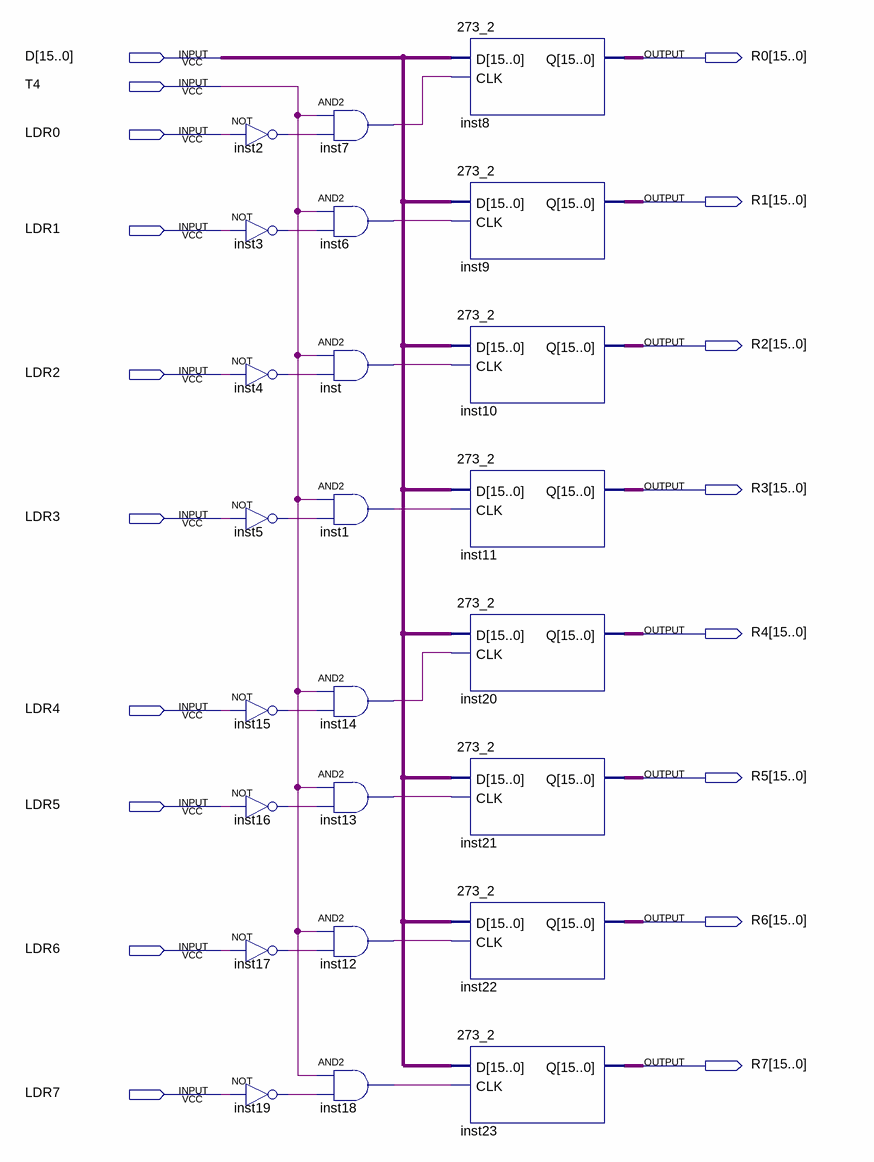
[diagram p0: schematic sheet]
// Quartus schematic reg_3.bdf as structural Verilog: 24 symbols, 18 pins
module reg_3 (
  input  [15:0] D,
  input  T4,
  input  LDR0,
  input  LDR1,
  input  LDR2,
  input  LDR3,
  input  LDR4,
  input  LDR5,
  input  LDR6,
  input  LDR7,
  output [15:0] R0,
  output [15:0] R1,
  output [15:0] R2,
  output [15:0] R3,
  output [15:0] R4,
  output [15:0] R5,
  output [15:0] R6,
  output [15:0] R7
);

  wire inst1_out, inst2_out, inst3_out, inst4_out, inst5_out, inst6_out, inst7_out, inst12_out, inst13_out,
       inst14_out, inst15_out, inst16_out, inst17_out, inst18_out, inst19_out, inst_out;

  not inst2 (inst2_out, LDR0);
  not inst3 (inst3_out, LDR1);
  not inst4 (inst4_out, LDR2);
  not inst5 (inst5_out, LDR3);
  not inst15 (inst15_out, LDR4);
  not inst16 (inst16_out, LDR5);
  not inst17 (inst17_out, LDR6);
  not inst19 (inst19_out, LDR7);
  and inst7 (inst7_out, T4, inst2_out);
  and inst6 (inst6_out, T4, inst3_out);
  and inst (inst_out, T4, inst4_out);
  and inst1 (inst1_out, T4, inst5_out);
  and inst14 (inst14_out, T4, inst15_out);
  and inst13 (inst13_out, T4, inst16_out);
  and inst12 (inst12_out, T4, inst17_out);
  and inst18 (inst18_out, T4, inst19_out);
  \273_2  inst8 (.D(D), .CLK(inst7_out), .Q(R0));
  \273_2  inst9 (.D(D), .CLK(inst6_out), .Q(R1));
  \273_2  inst10 (.D(D), .CLK(inst_out), .Q(R2));
  \273_2  inst11 (.D(D), .CLK(inst1_out), .Q(R3));
  \273_2  inst20 (.D(D), .CLK(inst14_out), .Q(R4));
  \273_2  inst21 (.D(D), .CLK(inst13_out), .Q(R5));
  \273_2  inst22 (.D(D), .CLK(inst12_out), .Q(R6));
  \273_2  inst23 (.D(D), .CLK(inst18_out), .Q(R7));
endmodule
